# Altium schematic sheet EG701_BMS.SchDoc (part 1 of 3)
size A3
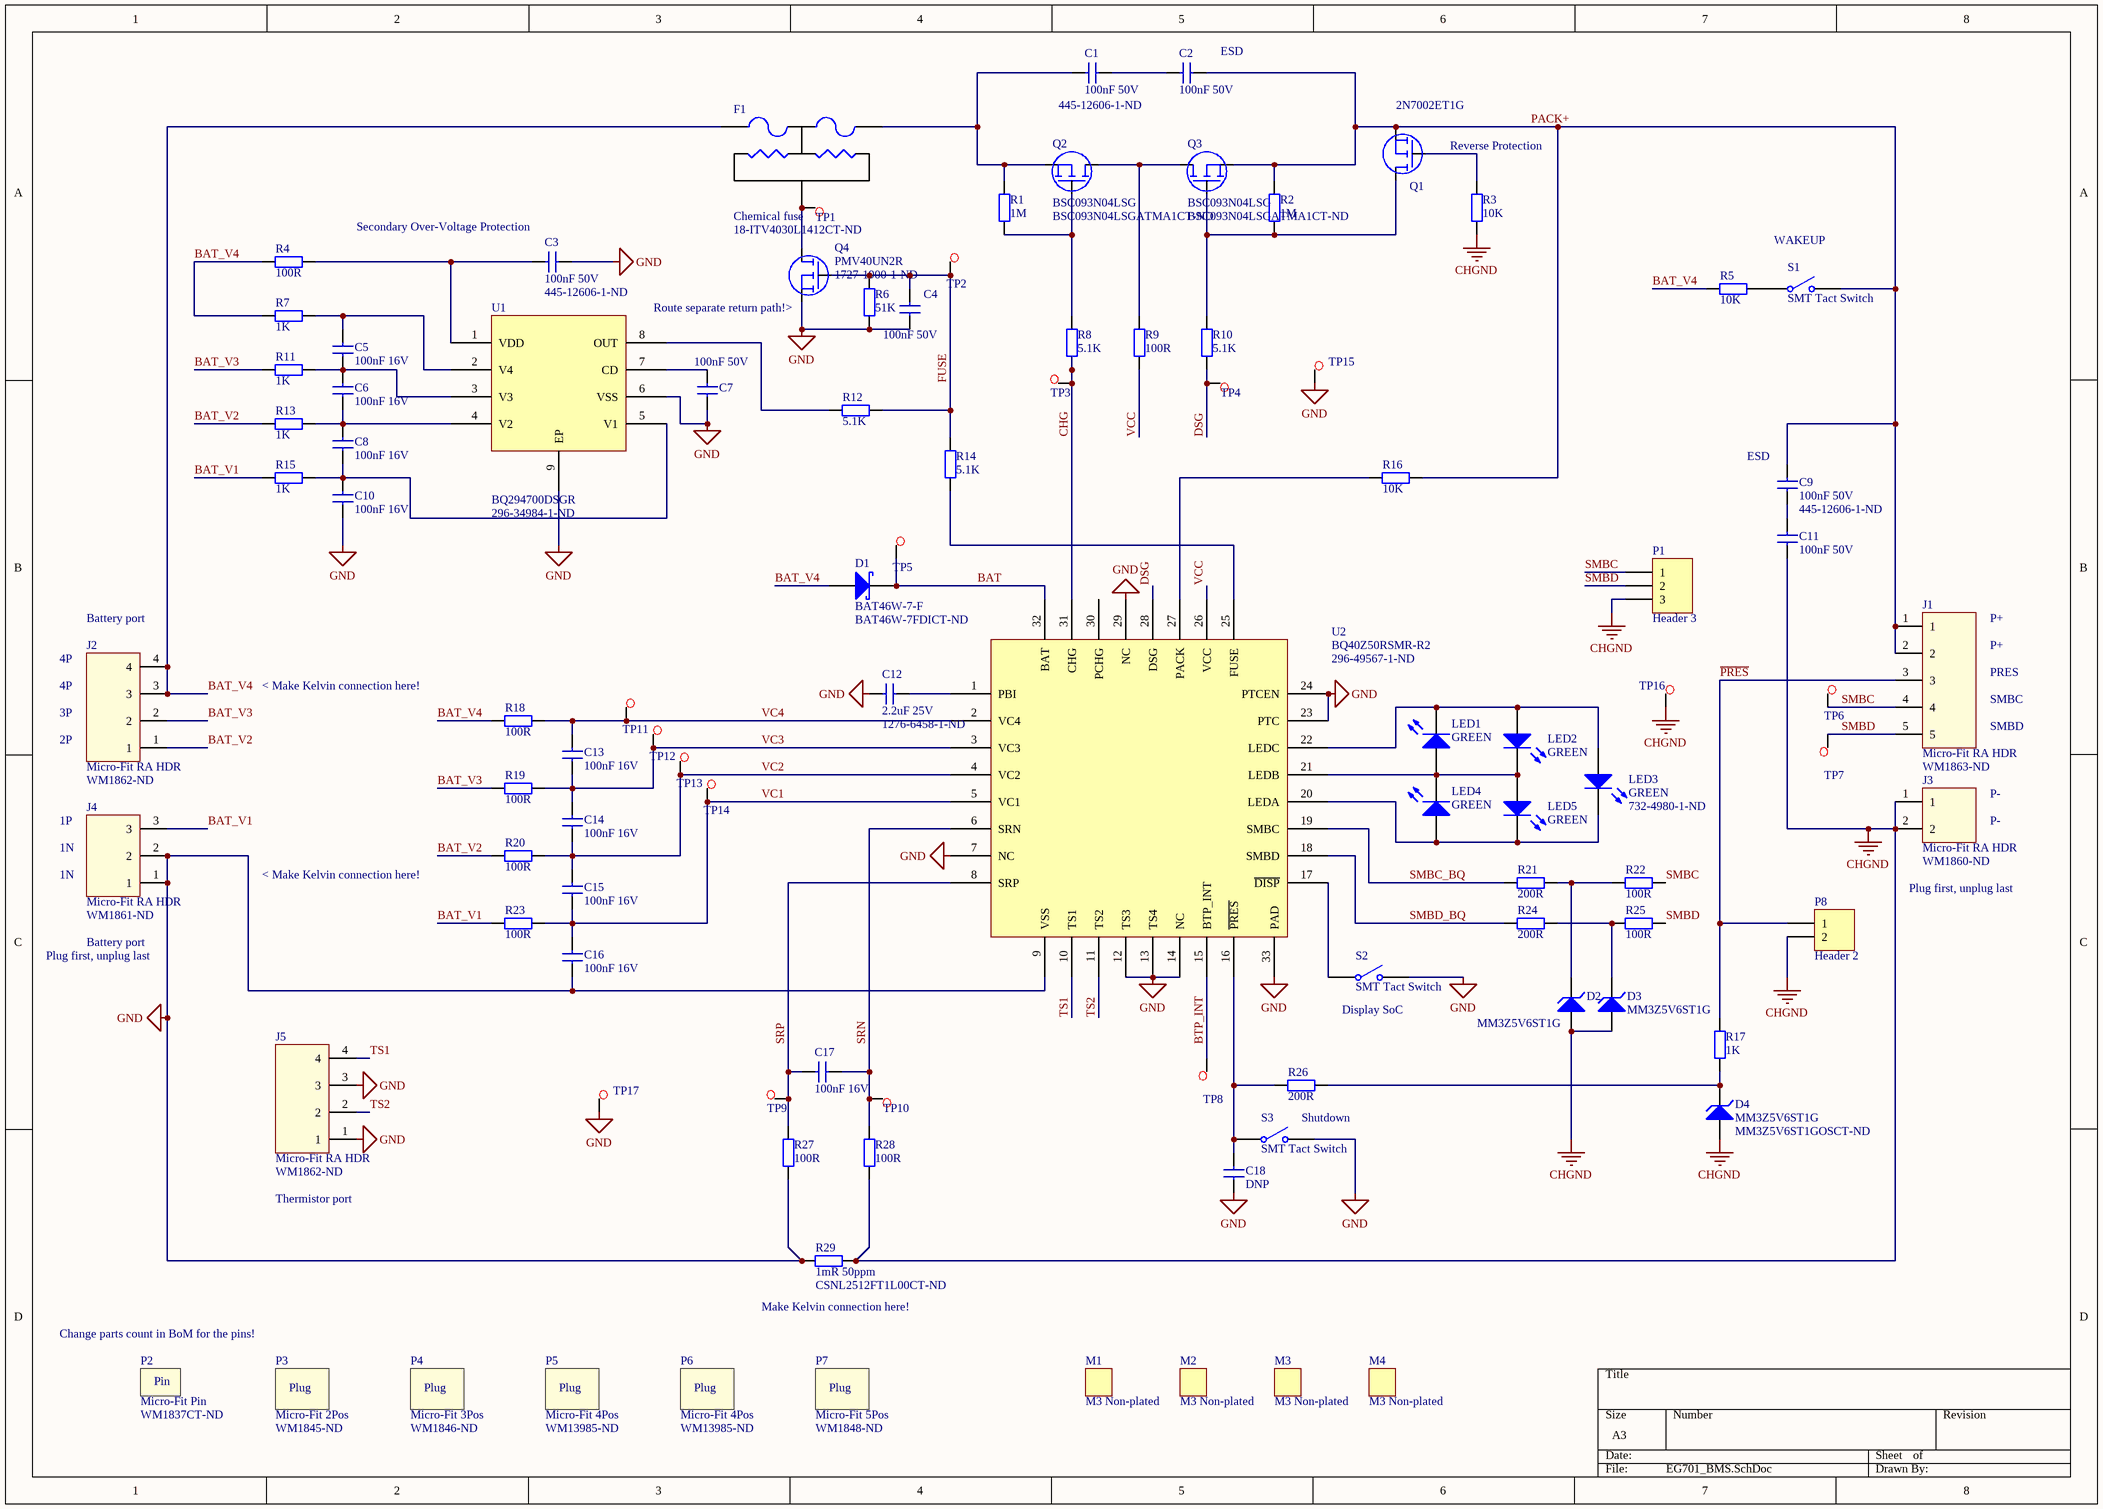
[diagram p0: EG701_BMS.SchDoc]

## Parts
C1  100nF 50V  Supplier Part Number 1: 445-12606-1-ND  [C0603_GENERIC]
C2  100nF 50V  [C0603_GENERIC]
C3  100nF 50V  Supplier Part Number 1: 445-12606-1-ND  [C0603_GENERIC]
C4  100nF 50V  [C0603_GENERIC]
C5  100nF 16V  [C0603_GENERIC]
C6  100nF 16V  [C0603_GENERIC]
C7  100nF 50V  [C0603_GENERIC]
C8  100nF 16V  [C0603_GENERIC]
C9  100nF 50V  Supplier Part Number 1: 445-12606-1-ND  [C0603_GENERIC]
C10  100nF 16V  [C0603_GENERIC]
C11  100nF 50V  [C0603_GENERIC]
C12  2.2uF 25V  Supplier Part Number 1: 1276-6458-1-ND  [C0603_GENERIC]
C13  100nF 16V  [C0603_GENERIC]
C14  100nF 16V  [C0603_GENERIC]
C15  100nF 16V  [C0603_GENERIC]
C16  100nF 16V  [C0603_GENERIC]
C17  100nF 16V  [C0603_GENERIC]
C18  DNP  [C0603_GENERIC]
D1  BAT46W-7-F  Supplier Part Number 1: BAT46W-7FDICT-ND  [SOD-123_GENERIC]
D2  MM3Z5V6ST1G  [SOD_323_GENERIC]
D3  MM3Z5V6ST1G  [SOD_323_GENERIC]
D4  MM3Z5V6ST1G  Supplier Part Number 1: MM3Z5V6ST1GOSCT-ND  [SOD_323_GENERIC]
F1  Chemical fuse  Supplier Part Number 1: 18-ITV4030L1412CT-ND  [ITV4030Lxxxx]
J1  Micro-Fit RA HDR  Supplier Part Number 1: WM1863-ND  [436500500]
J2  Micro-Fit RA HDR  Supplier Part Number 1: WM1862-ND  [436500400]
J3  Micro-Fit RA HDR  Supplier Part Number 1: WM1860-ND  [436500200]
J4  Micro-Fit RA HDR  Supplier Part Number 1: WM1861-ND  [436500300]
J5  Micro-Fit RA HDR  Supplier Part Number 1: WM1862-ND  [436500400]
LED1  GREEN  [LED_0603_GENERIC]
LED2  GREEN  [LED_0603_GENERIC]
LED3  GREEN  Supplier Part Number 1: 732-4980-1-ND  [LED_0603_GENERIC]
LED4  GREEN  [LED_0603_GENERIC]
LED5  GREEN  [LED_0603_GENERIC]
M1  M3 Non-plated  [M3_NONPLATED_GENERIC]
M2  M3 Non-plated  [M3_NONPLATED_GENERIC]
M3  M3 Non-plated  [M3_NONPLATED_GENERIC]
M4  M3 Non-plated  [M3_NONPLATED_GENERIC]
P1  Header 3  [HDR3_3D]
P2  Micro-Fit Pin  Supplier Part Number 1: WM1837CT-ND  (mechanical)
P3  Micro-Fit 2Pos  Supplier Part Number 1: WM1845-ND  (mechanical)
P4  Micro-Fit 3Pos  Supplier Part Number 1: WM1846-ND  (mechanical)
P5  Micro-Fit 4Pos  Supplier Part Number 1: WM13985-ND  (mechanical)
P6  Micro-Fit 4Pos  Supplier Part Number 1: WM13985-ND  (mechanical)
P7  Micro-Fit 5Pos  Supplier Part Number 1: WM1848-ND  (mechanical)
P8  Header 2  [HDR1X2]
Q1  2N7002ET1G  [SOT-23_GENERIC]
Q2  BSC093N04LSG  Supplier Part Number 1: BSC093N04LSGATMA1CT-ND  [TDSON-8]
Q3  BSC093N04LSG  Supplier Part Number 1: BSC093N04LSGATMA1CT-ND  [TDSON-8]
Q4  PMV40UN2R  Supplier Part Number 1: 1727-1900-1-ND  [SOT-23_GENERIC]
R1  1M  [R0603_GENERIC]
R2  1M  [R0603_GENERIC]
R3  10K  [R0603_GENERIC]
R4  100R  [R0603_GENERIC]
R5  10K  [R0603_GENERIC]
R6  51K  [R0603_GENERIC]
R7  1K  [R0603_GENERIC]
R8  5.1K  [R0603_GENERIC]
R9  100R  [R0603_GENERIC]
R10  5.1K  [R0603_GENERIC]
R11  1K  [R0603_GENERIC]
R12  5.1K  [R0603_GENERIC]
R13  1K  [R0603_GENERIC]
R14  5.1K  [R0603_GENERIC]
R15  1K  [R0603_GENERIC]
R16  10K  [R0603_GENERIC]
R17  1K  [R0603_GENERIC]
R18  100R  [R0603_GENERIC]
R19  100R  [R0603_GENERIC]
R20  100R  [R0603_GENERIC]
R21  200R  [R0603_GENERIC]
R22  100R  [R0603_GENERIC]
R23  100R  [R0603_GENERIC]
R24  200R  [R0603_GENERIC]
R25  100R  [R0603_GENERIC]
R26  200R  [R0603_GENERIC]
R27  100R  [R0603_GENERIC]
R28  100R  [R0603_GENERIC]
R29  1mR 50ppm  Supplier Part Number 1: CSNL2512FT1L00CT-ND  [R2512_M_GENERIC]
S1  SMT Tact Switch  [41-KRSM6-1]
S2  SMT Tact Switch  [41-KRSM6-1]
S3  SMT Tact Switch  [41-KRSM6-1]
TP1  Test Point TH  [TP_5021]  (value not drawn)
TP2  Test Point TH  [TP_5021]  (value not drawn)
TP3  Test Point TH  [TP_5021]  (value not drawn)
TP4  Test Point TH  [TP_5021]  (value not drawn)
TP5  Test Point TH  [TP_5021]  (value not drawn)
TP6  Test Point TH  [TP_5021]  (value not drawn)
TP7  Test Point TH  [TP_5021]  (value not drawn)
TP8  Test Point TH  [TP_5021]  (value not drawn)
TP9  Test Point TH  [TP_5021]  (value not drawn)
TP10  Test Point TH  [TP_5021]  (value not drawn)
TP11  Test Point TH  [TP_5021]  (value not drawn)
TP12  Test Point TH  [TP_5021]  (value not drawn)
TP13  Test Point TH  [TP_5021]  (value not drawn)
TP14  Test Point TH  [TP_5021]  (value not drawn)
TP15  Test Point TH  [TP_5021]  (value not drawn)
TP16  Test Point TH  [TP_5021]  (value not drawn)
TP17  Test Point TH  [TP_5021]  (value not drawn)
U1  BQ294700DSGR  Supplier Part Number 1: 296-34984-1-ND  [SON50P200X80_HS-9N]
U2  BQ40Z50RSMR-R2  Supplier Part Number 1: 296-49567-1-ND  [QFN40P400X400X100_HS-33N]

## Nets
CHGND: C11.1 D2.1(A) D3.1(A) D4.1(A) J3.1 J3.2 P1.3 P8.2 R3.1 R28.1 R29.2 TP16.1
GND: C3.1 C4.1 C7.1 C10.1 C12.2 C16.1 C18.1 J4.1 J4.2 J5.1 J5.3 Q4.2(S) R6.1 R27.1 R29.1 S2.2(NO) S3.2(NO) TP15.1 TP17.1 U1.6(VSS) U1.9(EP) U2.7(NC) U2.9(VSS) U2.12(TS3) U2.13(TS4) U2.14(NC) U2.23(PTC) U2.24(PTCEN) U2.29(NC) U2.33(PAD)
BAT: D1.2(K) TP5.1 U2.32(BAT)
BAT_V1: J4.3 R15.1 R23.1
BAT_V2: J2.1 R13.1 R20.1
BAT_V3: J2.2 R11.1 R19.1
BAT_V4: D1.1(A) F1.3 J2.3 J2.4 R4.1 R5.2 R7.1 R18.1
BTP_INT: TP8.1 U2.15(BTP_INT)
CHG: R8.1 TP3.1 U2.31(CHG)
DSG: R10.1 TP4.1 U2.28(DSG)
FUSE: C4.2 Q4.1(G) R6.2 R12.2 R14.2 TP2.1
~{PRES}: J1.3 P8.1 R17.2
PACK+: C2.2 C9.2 J1.1 J1.2 Q1.1(S) Q3.1(S) R2.2 R16.1 S1.2(NO)
SMBC: J1.4 P1.1 R22.2 TP6.1
SMBC_BQ: R21.1 U2.19(SMBC)
SMBD: J1.5 P1.2 R25.2 TP7.1
SMBD_BQ: R24.1 U2.18(SMBD)
SRN: C17.1 R28.2 TP10.1 U2.6(SRN)
SRP: C17.2 R27.2 TP9.1 U2.8(SRP)
TS1: J5.4 U2.10(TS1)
TS2: J5.2 U2.11(TS2)
VC1: C15.1 C16.2 R23.2 TP14.1 U2.5(VC1)
VC2: C14.1 C15.2 R20.2 TP13.1 U2.4(VC2)
VC3: C13.1 C14.2 R19.2 TP12.1 U2.3(VC3)
VC4: C13.2 R18.2 TP11.1 U2.2(VC4)
VCC: R9.1 U2.26(VCC)
NetC1_1: C1.1 F1.1 Q2.1(S) R1.2
NetC1_2: C1.2 C2.1
NetC3_2: C3.2 R4.2 U1.1(VDD)
NetC5_1: C5.1 C6.2 R11.2 U1.3(V3)
NetC5_2: C5.2 R7.2 U1.2(V4)
NetC6_1: C6.1 C8.2 R13.2 U1.4(V2)
NetC7_2: C7.2 U1.7(CD)
NetC8_1: C8.1 C10.2 R15.2 U1.5(V1)
NetC9_1: C9.1 C11.2
NetC12_1: C12.1 U2.1(PBI)
NetC18_2: C18.2 R26.1 S3.1(COMMON) U2.16(~{PRES})
NetD2_2: D2.2(K) R21.2 R22.1
NetD3_2: D3.2(K) R24.2 R25.1
NetD4_2: D4.2(K) R17.1 R26.2
NetF1_2: F1.2 Q4.3(D) TP1.1
NetLED1_1: LED1.1(K) LED2.2(A) LED3.2(A) U2.22(LEDC)
NetLED1_2: LED1.2(A) LED2.1(K) LED4.1(K) LED5.2(A) U2.21(LEDB)
NetLED3_1: LED3.1(K) LED4.2(A) LED5.1(K) U2.20(LEDA)
NetQ1_2: Q1.2(G) R3.2
NetQ1_3: Q1.3(D) Q3.4(G) R2.1 R10.2
NetQ2_4: Q2.4(G) R1.1 R8.2
NetQ2_5: Q2.5(D) Q3.5(D) R9.2
NetR5_1: R5.1 S1.1(COMMON)
NetR12_1: R12.1 U1.8(OUT)
NetR14_1: R14.1 U2.25(FUSE)
NetR16_2: R16.2 U2.27(PACK)
NetS2_1: S2.1(COMMON) U2.17(~{DISP})

Not connected (* = marked no-connect by the designer): U2 30(PCHG)

## Notes on the sheet
- (near C2) ESD
- Reverse Protection
- (near C3) Secondary Over-Voltage Protection
- WAKEUP
- (near Q4) Route separate return path!>
- (near C9) ESD
- (near J2) Battery port
- P+
- 4P
- 3P
- < Make Kelvin connection here!
- PRES
- SMBC
- 2P
- SMBD
- 1P
- 1N
- P-
- Plug first, unplug last
- Battery port
- (near S2) Display SoC
- Shutdown
- Thermistor port
- Make Kelvin connection here!
- (near P3) Change parts count in BoM for the pins!
- (in symbol 43030-0001) Pin
- (in symbol 43645-0200) Plug
- (in symbol 43645-0300) Plug
- (in symbol 43645-0408) Plug
- (in symbol 43645-0500) Plug